# Altium schematic sheet Esq_Ej3_Mealy.SchDoc
size A4
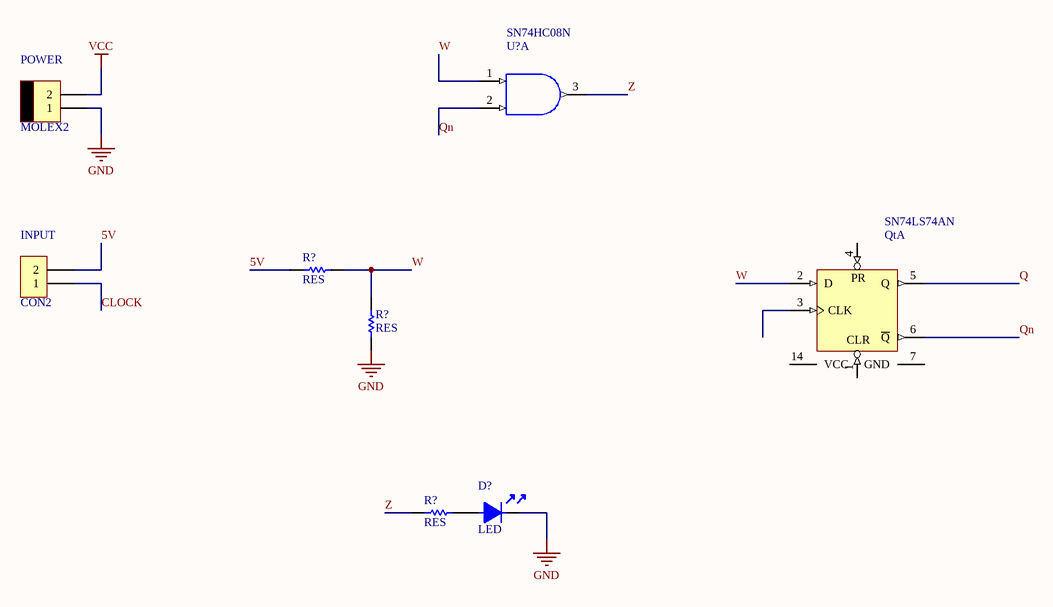
[diagram p0: Esq_Ej3_Mealy.SchDoc]

## Parts
(Parts that share a designator on the sheet are numbered #1, #2 ... from top to bottom, then left to right.)
D?  LED  [LED3]
INPUT  CON2  [SIP2]
POWER  MOLEX2  [MOLEX2]
Qt  SN74LS74AN  [N014D]  (part A of 2)
R?#1  RES  [RES400]
R?#2  RES  [RES400]
R?#3  RES  [RES400]
U?  SN74HC08N  [N014]  (part A of 4)

## Nets
GND: D?.2 POWER.1 R?#2.1 U?.7(GND)
VCC: POWER.2 U?.14(VCC)
5V: INPUT.2 R?#1.1
CLOCK: INPUT.1
Q: Qt.5(Q)
Qn: Qt.6(~{Q}) U?.2(B)
W: Qt.2(D) R?#1.2 R?#2.2 U?.1(A)
Z: R?#3.1 U?.3(Y)
NetD?_1: D?.1 R?#3.2

Not connected (* = marked no-connect by the designer): Qt 1(CLR) 3(CLK) 4(PR) 7(GND) 14(VCC)

## Library data of the parts
Qt = SN74LS74AN: Dual D-Type Positive-Edge-Triggered Flip-Flop with Preset and Clear; Published: 8-Jun-2000; LatestRevisionDate: 04-Mar-2005; LatestRevisionNote: Stylized 3D Model Added.; DatasheetVersion: Mar-1988; PackageVersion: Oct-1995; PackageReference: N014D; Publisher: Altium Limited; PackageDescription: DIP; 14 Leads; Row Spacing 7.62 mm; Pitch 2.54 mm; ComponentLink1Description: Manufacturer Link; ComponentLink1URL: http://www.ti.com/; ComponentLink2Description: Datasheet; ComponentLink2URL: http://www-s.ti.com/sc/ds/sn74ls74a.pdf
U? = SN74HC08N: Quadruple 2-Input Positive-AND Gate; Published: 8-Jun-2000; LatestRevisionDate: 04-Mar-2005; LatestRevisionNote: Stylized 3D Model Added.; DatasheetVersion: May-1997; PackageVersion: Oct-1995; PackageReference: N014; Publisher: Altium Limited; PackageDescription: DIP; 14 Leads; Row Spacing 7.62 mm; Pitch 2.54 mm; ComponentLink1Description: Manufacturer Link; ComponentLink1URL: http://www.ti.com/; ComponentLink2Description: Datasheet; ComponentLink2URL: http://www-s.ti.com/sc/ds/SN74HC08.pdf